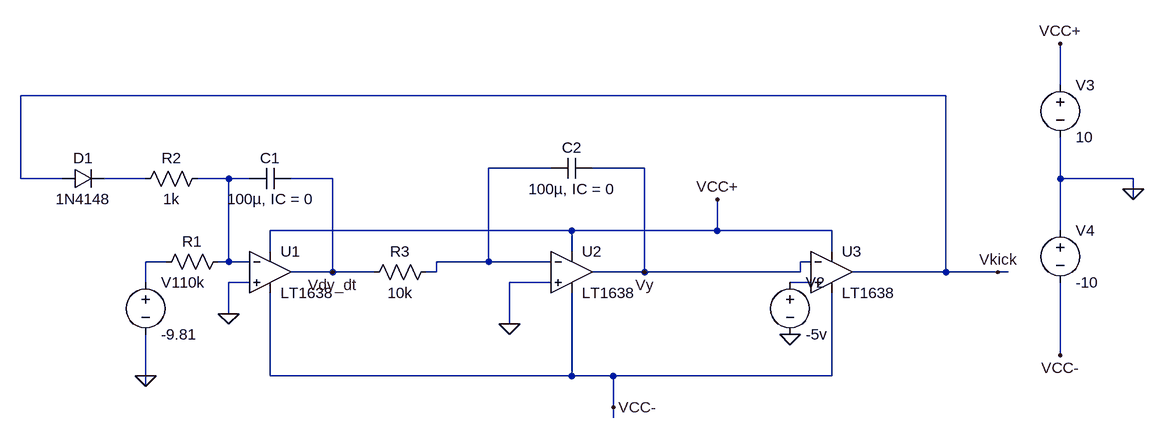
[diagram p0: schematic Draft1.asc]
Draft1.asc, the LTspice schematic file:
Version 4
SHEET 1 1428 680
WIRE 1296 -112 1296 -176
WIRE 1120 -96 -304 -96
WIRE 512 16 416 16
WIRE 656 16 576 16
WIRE -304 32 -304 -96
WIRE -240 32 -304 32
WIRE -112 32 -176 32
WIRE 16 32 -32 32
WIRE 48 32 16 32
WIRE 176 32 112 32
WIRE 1296 32 1296 -32
WIRE 1408 32 1296 32
WIRE 1408 48 1408 32
WIRE 1408 64 1408 48
WIRE 544 112 80 112
WIRE 768 112 768 64
WIRE 768 112 544 112
WIRE 944 112 768 112
WIRE 1296 112 1296 32
WIRE 80 144 80 112
WIRE 544 144 544 112
WIRE 944 144 944 112
WIRE -80 160 -112 160
WIRE 16 160 16 32
WIRE 16 160 0 160
WIRE 48 160 16 160
WIRE 416 160 416 16
WIRE 416 160 336 160
WIRE 512 160 416 160
WIRE 912 160 896 160
WIRE 176 176 176 32
WIRE 176 176 112 176
WIRE 240 176 176 176
WIRE 336 176 336 160
WIRE 336 176 320 176
WIRE 656 176 656 16
WIRE 656 176 576 176
WIRE 896 176 896 160
WIRE 896 176 656 176
WIRE 1120 176 1120 -96
WIRE 1120 176 976 176
WIRE 1200 176 1120 176
WIRE 1216 176 1200 176
WIRE -112 192 -112 160
WIRE 48 192 16 192
WIRE 512 192 448 192
WIRE 912 192 880 192
WIRE 16 240 16 192
WIRE 448 256 448 192
WIRE 1296 304 1296 192
WIRE -112 336 -112 272
WIRE 80 336 80 208
WIRE 544 336 544 208
WIRE 544 336 80 336
WIRE 608 336 544 336
WIRE 944 336 944 208
WIRE 944 336 608 336
WIRE -112 352 -112 336
WIRE 608 384 608 336
WIRE 608 400 608 384
FLAG -112 336 0
FLAG 16 240 0
FLAG 448 256 0
FLAG 880 272 0
FLAG 176 176 Vdy_dt
FLAG 656 176 Vy
FLAG 1408 48 0
FLAG 1296 -176 VCC+
FLAG 1296 304 VCC-
FLAG 768 64 VCC+
FLAG 608 384 VCC-
FLAG 1200 176 Vkick
SYMBOL OpAmps\\LT1638 80 112 R0
SYMATTR InstName U1
SYMBOL OpAmps\\LT1638 544 112 R0
SYMATTR InstName U2
SYMBOL OpAmps\\LT1638 944 112 R0
SYMATTR InstName U3
SYMBOL res 16 144 R90
WINDOW 0 0 56 VBottom 2
WINDOW 3 32 56 VTop 2
SYMATTR InstName R1
SYMATTR Value 10k
SYMBOL voltage -112 176 R0
WINDOW 123 0 0 Left 0
WINDOW 39 0 0 Left 0
SYMATTR InstName V1
SYMATTR Value -9.81
SYMBOL cap 112 16 R90
WINDOW 0 0 32 VBottom 2
WINDOW 3 32 32 VTop 2
SYMATTR InstName C1
SYMATTR Value 100µ, IC = 0
SYMBOL res -16 16 R90
WINDOW 0 0 56 VBottom 2
WINDOW 3 32 56 VTop 2
SYMATTR InstName R2
SYMATTR Value 1k
SYMBOL diode -240 48 R270
WINDOW 0 32 32 VTop 2
WINDOW 3 0 32 VBottom 2
SYMATTR InstName D1
SYMATTR Value 1N4148
SYMBOL res 336 160 R90
WINDOW 0 0 56 VBottom 2
WINDOW 3 32 56 VTop 2
SYMATTR InstName R3
SYMATTR Value 10k
SYMBOL cap 576 0 R90
WINDOW 0 0 32 VBottom 2
WINDOW 3 32 32 VTop 2
SYMATTR InstName C2
SYMATTR Value 100µ, IC = 0
SYMBOL voltage 880 176 R0
WINDOW 123 0 0 Left 0
WINDOW 39 0 0 Left 0
SYMATTR InstName V2
SYMATTR Value -5v
SYMBOL voltage 1296 -128 R0
WINDOW 123 0 0 Left 0
WINDOW 39 0 0 Left 0
SYMATTR InstName V3
SYMATTR Value 10
SYMBOL voltage 1296 96 R0
WINDOW 123 0 0 Left 0
WINDOW 39 0 0 Left 0
SYMATTR InstName V4
SYMATTR Value -10

The netlist it stands for:
* Draft1.asc
XU1 0 N003 VCC+ VCC- Vdy_dt LT1638  ; pins In+ In- V+ V- OUT
XU2 0 N001 VCC+ VCC- Vy LT1638  ; pins In+ In- V+ V- OUT
XU3 N005 Vy VCC+ VCC- Vkick LT1638  ; pins In+ In- V+ V- OUT
R1 N003 N004 10k
V1 N004 0 -9.81
C1 Vdy_dt N003 100µ, IC = 0
R2 N003 N002 1k
D1 Vkick N002 1N4148
R3 N001 Vdy_dt 10k
C2 Vy N001 100µ, IC = 0
V2 N005 0 -5v
V3 VCC+ 0 10
V4 0 VCC- -10
.model D D
.lib standard.dio
.backanno
.end